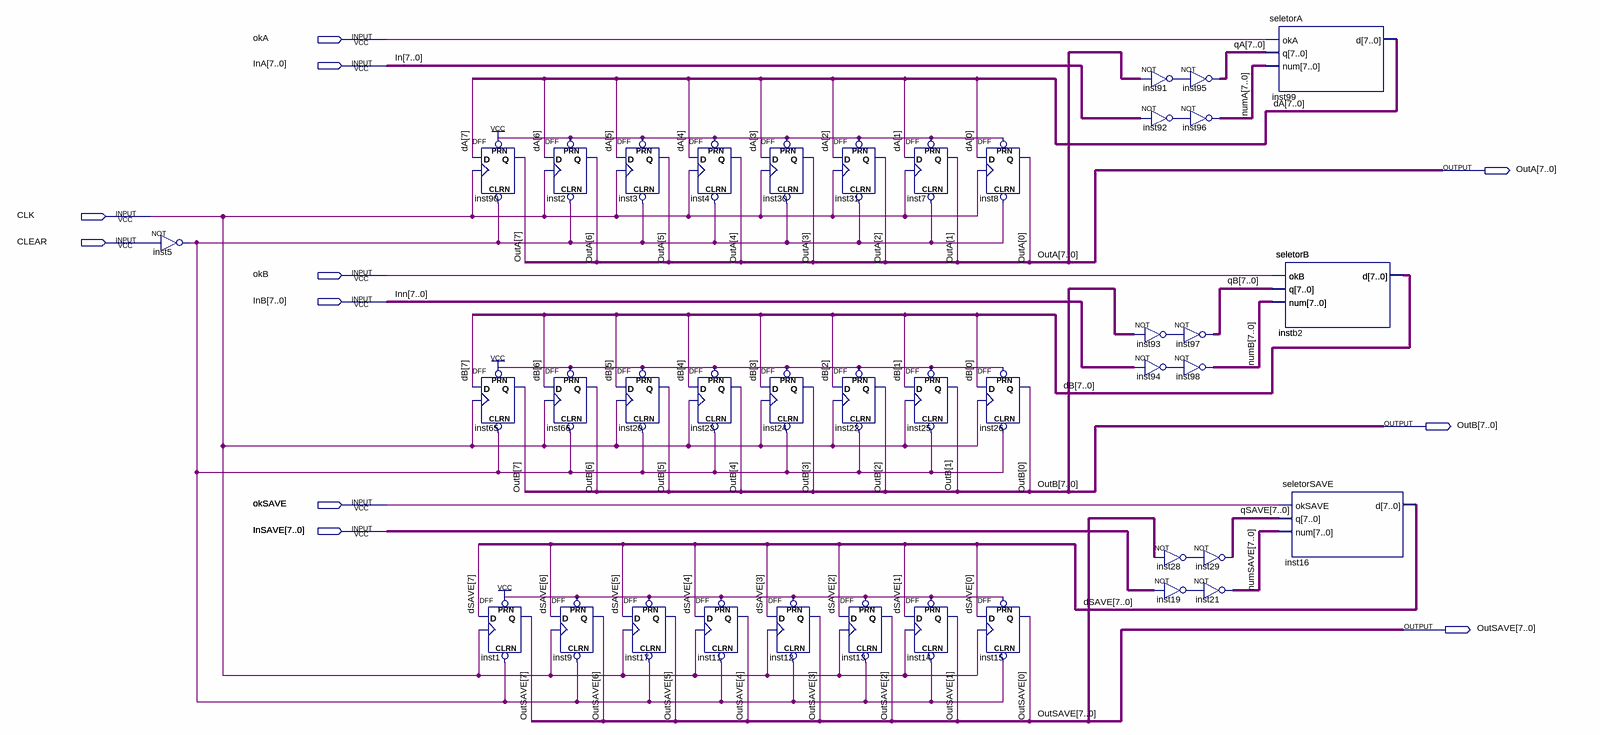
[diagram p0: schematic sheet]
// Quartus schematic memnum.bdf as structural Verilog: 41 symbols, 11 pins
module memnum (
  input  okA,
  input  [7:0] InA,
  input  CLK,
  input  CLEAR,
  input  okB,
  input  [7:0] InB,
  input  okSAVE,
  input  [7:0] InSAVE,
  output [7:0] OutA,
  output [7:0] OutB,
  output [7:0] OutSAVE
);

  wire inst5_out, inst19_out, inst28_out, inst91_out, inst92_out, inst93_out, inst94_out;
  wire [7:0] dA, dB, dSAVE, numA, numB, numSAVE, qA, qB, qSAVE;

  not inst5 (inst5_out, CLEAR);
  DFF inst90 (.CLRN(inst5_out), .CLK(CLK), .D(dA[7]), .PRN(1'b1), .Q(OutA[7]));
  DFF inst65 (.CLRN(inst5_out), .CLK(CLK), .D(dB[7]), .PRN(1'b1), .Q(OutB[7]));
  DFF inst1 (.CLRN(inst5_out), .CLK(CLK), .D(dSAVE[7]), .PRN(1'b1), .Q(OutSAVE[7]));
  DFF inst2 (.CLRN(inst5_out), .CLK(CLK), .D(dA[6]), .PRN(1'b1), .Q(OutA[6]));
  DFF inst66 (.CLRN(inst5_out), .CLK(CLK), .D(dB[6]), .PRN(1'b1), .Q(OutB[6]));
  DFF inst9 (.CLRN(inst5_out), .CLK(CLK), .D(dSAVE[6]), .PRN(1'b1), .Q(OutSAVE[6]));
  DFF inst3 (.CLRN(inst5_out), .CLK(CLK), .D(dA[5]), .PRN(1'b1), .Q(OutA[5]));
  DFF inst20 (.CLRN(inst5_out), .CLK(CLK), .D(dB[5]), .PRN(1'b1), .Q(OutB[5]));
  DFF inst17 (.CLRN(inst5_out), .CLK(CLK), .D(dSAVE[5]), .PRN(1'b1), .Q(OutSAVE[5]));
  DFF inst4 (.CLRN(inst5_out), .CLK(CLK), .D(dA[4]), .PRN(1'b1), .Q(OutA[4]));
  DFF inst23 (.CLRN(inst5_out), .CLK(CLK), .D(dB[4]), .PRN(1'b1), .Q(OutB[4]));
  DFF inst11 (.CLRN(inst5_out), .CLK(CLK), .D(dSAVE[4]), .PRN(1'b1), .Q(OutSAVE[4]));
  DFF inst30 (.CLRN(inst5_out), .CLK(CLK), .D(dA[3]), .PRN(1'b1), .Q(OutA[3]));
  DFF inst24 (.CLRN(inst5_out), .CLK(CLK), .D(dB[3]), .PRN(1'b1), .Q(OutB[3]));
  DFF inst12 (.CLRN(inst5_out), .CLK(CLK), .D(dSAVE[3]), .PRN(1'b1), .Q(OutSAVE[3]));
  DFF inst31 (.CLRN(inst5_out), .CLK(CLK), .D(dA[2]), .PRN(1'b1), .Q(OutA[2]));
  DFF inst22 (.CLRN(inst5_out), .CLK(CLK), .D(dB[2]), .PRN(1'b1), .Q(OutB[2]));
  DFF inst13 (.CLRN(inst5_out), .CLK(CLK), .D(dSAVE[2]), .PRN(1'b1), .Q(OutSAVE[2]));
  DFF inst7 (.CLRN(inst5_out), .CLK(CLK), .D(dA[1]), .PRN(1'b1), .Q(OutA[1]));
  DFF inst25 (.CLRN(inst5_out), .CLK(CLK), .D(dB[1]), .PRN(1'b1), .Q(OutB[1]));
  DFF inst14 (.CLRN(inst5_out), .CLK(CLK), .D(dSAVE[1]), .PRN(1'b1), .Q(OutSAVE[1]));
  DFF inst8 (.CLRN(inst5_out), .CLK(CLK), .D(dA[0]), .PRN(1'b1), .Q(OutA[0]));
  DFF inst26 (.CLRN(inst5_out), .CLK(CLK), .D(dB[0]), .PRN(1'b1), .Q(OutB[0]));
  DFF inst15 (.CLRN(inst5_out), .CLK(CLK), .D(dSAVE[0]), .PRN(1'b1), .Q(OutSAVE[0]));
  assign inst91_out = ~OutA;  // NOT inst91, 8 bits wide
  assign inst92_out = ~InA;  // NOT inst92, 8 bits wide
  assign inst93_out = ~OutB;  // NOT inst93, 8 bits wide
  assign inst94_out = ~InB;  // NOT inst94, 8 bits wide
  assign qA = ~{8{inst91_out}};  // NOT inst95, 8 bits wide
  assign numA = ~{8{inst92_out}};  // NOT inst96, 8 bits wide
  assign qB = ~{8{inst93_out}};  // NOT inst97, 8 bits wide
  assign numB = ~{8{inst94_out}};  // NOT inst98, 8 bits wide
  assign inst28_out = ~OutSAVE;  // NOT inst28, 8 bits wide
  assign qSAVE = ~{8{inst28_out}};  // NOT inst29, 8 bits wide
  assign inst19_out = ~InSAVE;  // NOT inst19, 8 bits wide
  assign numSAVE = ~{8{inst19_out}};  // NOT inst21, 8 bits wide
  seletorA inst99 (.okA(okA), .q(qA), .num(numA), .d(dA));
  seletorB inst (.okB(okB), .q(qB), .num(numB), .d(dB));
  seletorB instb2 (.okB(okB), .q(qB), .num(numB), .d(dB));
  seletorSAVE inst16 (.okSAVE(okSAVE), .q(qSAVE), .num(numSAVE), .d(dSAVE));

  // Other names for the same wires on the sheet: In[7:0] = InA; Inn[7:0] = InB
endmodule
